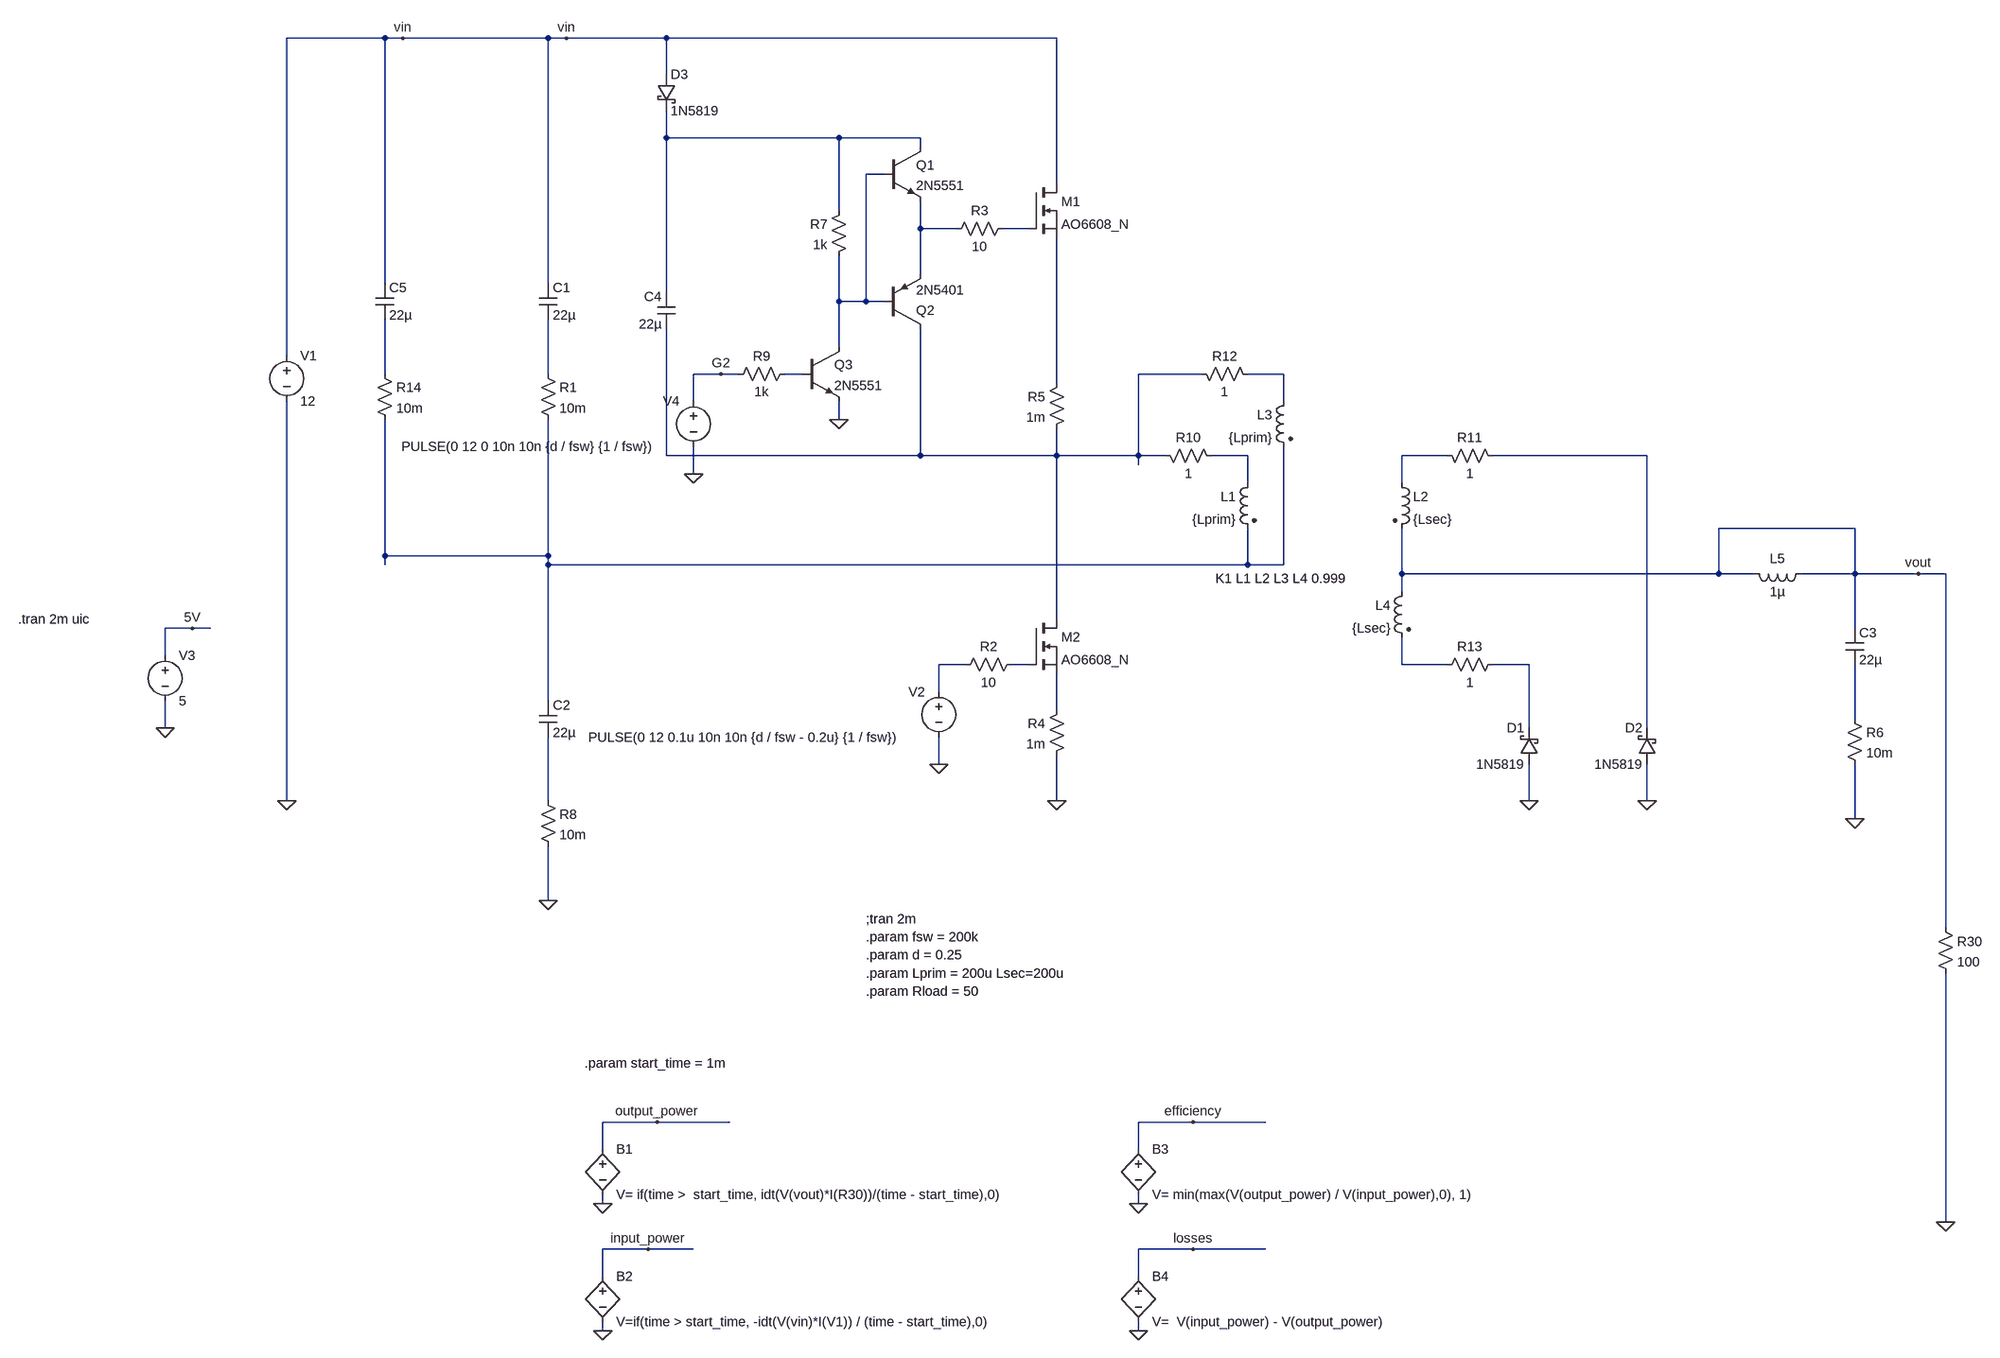
[diagram p0: schematic intentionally_disbalanced_half_bridge.asc]
intentionally_disbalanced_half_bridge.asc, the LTspice schematic file:
Version 4
SHEET 1 11460 3748
WIRE -16 -272 -432 -272
WIRE 16 -272 -16 -272
WIRE 272 -272 16 -272
WIRE 304 -272 272 -272
WIRE 480 -272 304 -272
WIRE 1168 -272 480 -272
WIRE 480 -208 480 -272
WIRE 480 -96 480 -144
WIRE 784 -96 480 -96
WIRE 928 -96 784 -96
WIRE 928 -80 928 -96
WIRE 864 -32 832 -32
WIRE 1168 -16 1168 -272
WIRE 784 32 784 -96
WIRE 928 64 928 16
WIRE 992 64 928 64
WIRE 1120 64 1072 64
WIRE 928 144 928 64
WIRE -16 160 -16 -272
WIRE 272 160 272 -272
WIRE 480 176 480 -96
WIRE 784 192 784 112
WIRE 832 192 832 -32
WIRE 832 192 784 192
WIRE 864 192 832 192
WIRE 784 272 784 192
WIRE -432 288 -432 -272
WIRE -16 320 -16 224
WIRE 272 320 272 224
WIRE 576 320 528 320
WIRE 608 320 576 320
WIRE 720 320 688 320
WIRE 1424 320 1312 320
WIRE 1568 320 1504 320
WIRE 1168 336 1168 80
WIRE 528 368 528 320
WIRE 1568 368 1568 320
WIRE 784 400 784 368
WIRE 480 464 480 240
WIRE 928 464 928 240
WIRE 928 464 480 464
WIRE 1168 464 1168 416
WIRE 1168 464 928 464
WIRE 1312 464 1312 320
WIRE 1312 464 1168 464
WIRE 1360 464 1312 464
WIRE 1504 464 1440 464
WIRE 1856 464 1776 464
WIRE 2208 464 1936 464
WIRE 1312 480 1312 464
WIRE 528 496 528 448
WIRE 1504 512 1504 464
WIRE 1776 512 1776 464
WIRE 2624 592 2384 592
WIRE -16 640 -16 400
WIRE 272 640 272 400
WIRE 272 640 -16 640
WIRE -16 656 -16 640
WIRE 272 656 272 640
WIRE 1504 656 1504 592
WIRE 1504 656 272 656
WIRE 1568 656 1568 448
WIRE 1568 656 1504 656
WIRE 1776 672 1776 592
WIRE 2384 672 2384 592
WIRE 2384 672 1776 672
WIRE 2448 672 2384 672
WIRE 2624 672 2624 592
WIRE 2624 672 2528 672
WIRE 2736 672 2624 672
WIRE 2784 672 2736 672
WIRE 1776 704 1776 672
WIRE 1168 752 1168 464
WIRE -1552 768 -1600 768
WIRE -1520 768 -1552 768
WIRE 2624 768 2624 672
WIRE -1600 816 -1600 768
WIRE 1008 832 960 832
WIRE 1120 832 1088 832
WIRE 1776 832 1776 784
WIRE 1856 832 1776 832
WIRE 2000 832 1936 832
WIRE 960 880 960 832
WIRE 272 896 272 656
WIRE 1168 912 1168 848
WIRE 2624 928 2624 832
WIRE -1600 944 -1600 896
WIRE 2000 944 2000 832
WIRE 2208 944 2208 464
WIRE 960 1008 960 960
WIRE -432 1072 -432 368
WIRE 272 1072 272 960
WIRE 1168 1072 1168 992
WIRE 2000 1072 2000 1008
WIRE 2208 1072 2208 1008
WIRE 2624 1104 2624 1008
WIRE 272 1248 272 1152
WIRE 2784 1296 2784 672
WIRE 464 1680 368 1680
WIRE 592 1680 464 1680
WIRE 1408 1680 1312 1680
WIRE 1536 1680 1408 1680
WIRE 368 1728 368 1680
WIRE 1312 1728 1312 1680
WIRE 368 1824 368 1808
WIRE 1312 1824 1312 1808
WIRE 2784 1856 2784 1376
WIRE 448 1904 368 1904
WIRE 528 1904 448 1904
WIRE 1408 1904 1312 1904
WIRE 1536 1904 1408 1904
WIRE 368 1952 368 1904
WIRE 1312 1952 1312 1904
WIRE 368 2048 368 2032
WIRE 1312 2048 1312 2032
FLAG 960 1008 0
FLAG 1168 1072 0
FLAG -432 1072 0
FLAG 576 320 G2
FLAG 304 -272 vin
FLAG 2736 672 vout
FLAG 368 1824 0
FLAG 368 2048 0
FLAG 464 1680 output_power
FLAG 448 1904 input_power
FLAG 1312 1824 0
FLAG 1408 1680 efficiency
FLAG 1312 2048 0
FLAG 1408 1904 losses
FLAG 2784 1856 0
FLAG 272 1248 0
FLAG 2624 1104 0
FLAG 2208 1072 0
FLAG 2000 1072 0
FLAG 784 400 0
FLAG -1600 944 0
FLAG -1552 768 5V
FLAG 528 496 0
FLAG 16 -272 vin
SYMBOL res 2768 1280 R0
SYMATTR InstName R30
SYMATTR Value 100
SYMBOL res 1104 816 R90
WINDOW 0 0 56 VBottom 2
WINDOW 3 32 56 VTop 2
SYMATTR InstName R2
SYMATTR Value 10
SYMBOL voltage -432 272 R0
WINDOW 123 0 0 Left 0
WINDOW 39 0 0 Left 0
SYMATTR InstName V1
SYMATTR Value 12
SYMBOL res 1088 48 R90
WINDOW 0 0 56 VBottom 2
WINDOW 3 32 56 VTop 2
SYMATTR InstName R3
SYMATTR Value 10
SYMBOL voltage 960 864 M0
WINDOW 123 0 0 Left 0
WINDOW 39 0 0 Left 0
WINDOW 3 72 96 Left 2
SYMATTR Value PULSE(0 12 0.1u 10n 10n {d / fsw - 0.2u} {1 / fsw})
SYMATTR InstName V2
SYMBOL res 1184 896 M0
SYMATTR InstName R4
SYMATTR Value 1m
SYMBOL res 1184 320 M0
SYMATTR InstName R5
SYMATTR Value 1m
SYMBOL bv 368 1712 R0
SYMATTR InstName B1
SYMATTR Value V= if(time >  start_time, idt(V(vout)*I(R30))/(time - start_time),0)
SYMBOL bv 368 1936 R0
SYMATTR InstName B2
SYMATTR Value V=if(time > start_time, -idt(V(vin)*I(V1)) / (time - start_time),0)
SYMBOL bv 1312 1712 R0
SYMATTR InstName B3
SYMATTR Value V= min(max(V(output_power) / V(input_power),0), 1)
SYMBOL bv 1312 1936 R0
SYMATTR InstName B4
SYMATTR Value V=  V(input_power) - V(output_power)
SYMBOL schottky 2016 1008 R180
WINDOW 0 24 64 Left 2
WINDOW 3 24 0 Left 2
SYMATTR InstName D1
SYMATTR Value 1N5819
SYMATTR Description Diode
SYMATTR Type diode
SYMBOL schottky 2224 1008 R180
WINDOW 0 24 64 Left 2
WINDOW 3 24 0 Left 2
SYMATTR InstName D2
SYMATTR Value 1N5819
SYMATTR Description Diode
SYMATTR Type diode
SYMBOL nmos 1120 -16 R0
SYMATTR InstName M1
SYMATTR Value AO6608_N
SYMBOL ind2 1520 496 M0
SYMATTR InstName L1
SYMATTR Value {Lprim}
SYMATTR Type ind
SYMBOL ind2 1760 496 R0
SYMATTR InstName L2
SYMATTR Value {Lsec}
SYMATTR Type ind
SYMBOL res 1456 480 M270
WINDOW 0 32 56 VTop 2
WINDOW 3 0 56 VBottom 2
SYMATTR InstName R10
SYMATTR Value 1
SYMBOL res 1952 480 M270
WINDOW 0 32 56 VTop 2
WINDOW 3 0 56 VBottom 2
SYMATTR InstName R11
SYMATTR Value 1
SYMBOL ind2 1584 352 M0
SYMATTR InstName L3
SYMATTR Value {Lprim}
SYMATTR Type ind
SYMBOL res 1520 336 M270
WINDOW 0 32 56 VTop 2
WINDOW 3 0 56 VBottom 2
SYMATTR InstName R12
SYMATTR Value 1
SYMBOL ind2 1792 688 M0
SYMATTR InstName L4
SYMATTR Value {Lsec}
SYMATTR Type ind
SYMBOL res 1952 816 R90
WINDOW 0 0 56 VBottom 2
WINDOW 3 32 56 VTop 2
SYMATTR InstName R13
SYMATTR Value 1
SYMBOL nmos 1120 752 R0
SYMATTR InstName M2
SYMATTR Value AO6608_N
SYMBOL res 256 304 R0
SYMATTR InstName R1
SYMATTR Value 10m
SYMBOL res 256 1056 R0
SYMATTR InstName R8
SYMATTR Value 10m
SYMBOL cap 256 160 R0
SYMATTR InstName C1
SYMATTR Value 22µ
SYMBOL cap 256 896 R0
SYMATTR InstName C2
SYMATTR Value 22µ
SYMBOL res 2608 912 R0
SYMATTR InstName R6
SYMATTR Value 10m
SYMBOL cap 2608 768 R0
SYMATTR InstName C3
SYMATTR Value 22µ
SYMBOL ind 2544 656 R90
WINDOW 0 5 56 VBottom 2
WINDOW 3 32 56 VTop 2
SYMATTR InstName L5
SYMATTR Value 1µ
SYMBOL schottky 464 -208 R0
SYMATTR InstName D3
SYMATTR Value 1N5819
SYMATTR Description Diode
SYMATTR Type diode
SYMBOL cap 496 176 M0
SYMATTR InstName C4
SYMATTR Value 22µ
SYMBOL res 800 16 M0
SYMATTR InstName R7
SYMATTR Value 1k
SYMBOL npn 864 -80 R0
SYMATTR InstName Q1
SYMATTR Value 2N5551
SYMBOL pnp 864 240 M180
SYMATTR InstName Q2
SYMATTR Value 2N5401
SYMBOL npn 720 272 R0
SYMATTR InstName Q3
SYMATTR Value 2N5551
SYMBOL res 704 304 R90
WINDOW 0 0 56 VBottom 2
WINDOW 3 32 56 VTop 2
SYMATTR InstName R9
SYMATTR Value 1k
SYMBOL voltage -1600 800 R0
WINDOW 123 0 0 Left 0
WINDOW 39 0 0 Left 0
SYMATTR InstName V3
SYMATTR Value 5
SYMBOL voltage 528 352 M0
WINDOW 123 0 0 Left 0
WINDOW 39 0 0 Left 0
WINDOW 3 72 96 Left 2
SYMATTR Value PULSE(0 12 0 10n 10n {d / fsw} {1 / fsw})
SYMATTR InstName V4
SYMBOL res -32 304 R0
SYMATTR InstName R14
SYMATTR Value 10m
SYMBOL cap -32 160 R0
SYMATTR InstName C5
SYMATTR Value 22µ
TEXT 832 1280 Left 2 !;tran 2m
TEXT 832 1312 Left 2 !.param fsw = 200k
TEXT 832 1344 Left 2 !.param d = 0.25
TEXT 832 1408 Left 2 !.param Rload = 50
TEXT 832 1376 Left 2 !.param Lprim = 200u Lsec=200u
TEXT -3264 752 Left 2 !.tran 2m uic
TEXT 336 1576 Left 2 !.param start_time = 1m
TEXT 1448 680 Left 2 !K1 L1 L2 L3 L4 0.999

The netlist it stands for:
* intentionally_disbalanced_half_bridge.asc
R30 vout 0 100
R2 N016 N015 10
V1 vin 0 12
R3 N004 N003 10
V2 N015 0 PULSE(0 12 0.1u 10n 10n {d / fsw - 0.2u} {1 / fsw})
R4 N019 0 1m
R5 N010 N008 1m
B1 output_power 0 V= if(time >  start_time, idt(V(vout)*I(R30))/(time - start_time),0)
B2 input_power 0 V=if(time > start_time, -idt(V(vin)*I(V1)) / (time - start_time),0)
B3 efficiency 0 V= min(max(V(output_power) / V(input_power),0), 1)
B4 losses 0 V=  V(input_power) - V(output_power)
D1 0 N018 1N5819
D2 0 N013 1N5819
M1 vin N004 N010 N010 AO6608_N
L1 N011 N014 {Lprim}
L2 N012 vout {Lsec}
R10 N011 N008 1
R11 N013 N012 1
L3 N009 N014 {Lprim}
R12 N009 N008 1
L4 vout N017 {Lsec}
R13 N018 N017 1
M2 N008 N016 N019 N019 AO6608_N
R1 N006 N014 10m
R8 N021 0 10m
C1 vin N006 22µ
C2 N014 N021 22µ
R6 N020 0 10m
C3 vout N020 22µ
L5 vout vout 1µ
D3 vin N001 1N5819
C4 N001 N008 22µ
R7 N001 N002 1k
Q1 N001 N002 N003 0 2N5551
Q2 N008 N002 N003 0 2N5401
Q3 N002 N007 0 0 2N5551
R9 N007 G2 1k
V3 5V 0 5
V4 G2 0 PULSE(0 12 0 10n 10n {d / fsw} {1 / fsw})
R14 N005 N014 10m
C5 vin N005 22µ
.model D D
.lib standard.dio
.model NPN NPN
.model PNP PNP
.lib standard.bjt
.model NMOS NMOS
.model PMOS PMOS
.lib standard.mos
;tran 2m
.param fsw = 200k
.param d = 0.25
.param Rload = 50
.param Lprim = 200u Lsec=200u
.tran 2m uic
.param start_time = 1m
K1 L1 L2 L3 L4 0.999
.backanno
.end